# Altium schematic sheet Signal.SchDoc
size A4; SheetNumber: 2; SheetTotal: 5
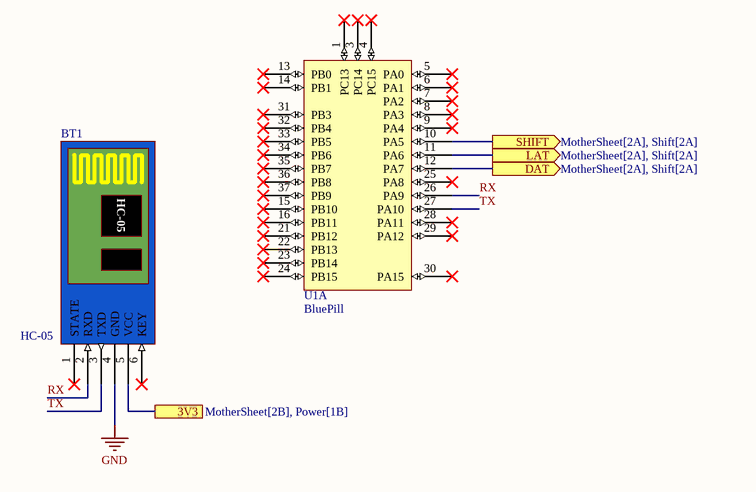
[diagram p0: Signal.SchDoc]

## Parts
BT1  HC-05  [HC-05]
U1  BluePill  [BluePill]  (part A of 2)

## Ports
3V3 (see MotherSheet[2B], Power[1B]), DAT (out, see MotherSheet[2A], Shift[2A]), LAT (out, see MotherSheet[2A], Shift[2A]), SHIFT (out, see MotherSheet[2A], Shift[2A])

## Nets
GND: BT1.4(GND)
3V3: BT1.5(VCC) ; port 3V3
DAT: U1.12(PA7) ; port DAT
LAT: U1.11(PA6) ; port LAT
RX: BT1.2(RXD) U1.26(PA9)
SHIFT: U1.10(PA5) ; port SHIFT
TX: BT1.3(TXD) U1.27(PA10)

Not connected (* = marked no-connect by the designer): BT1 1(STATE)* 6(KEY)*; U1 1(PC13)* 3(PC14)* 4(PC15)* 5(PA0)* 6(PA1)* 7(PA2)* 8(PA3)* 9(PA4)* 13(PB0)* 14(PB1)* 15(PB10)* 16(PB11)* 21(PB12)* 22(PB13)* 23(PB14)* 24(PB15)* 25(PA8)* 28(PA11)* 29(PA12)* 30(PA15)* 31(PB3)* 32(PB4)* 33(PB5)* 34(PB6)* 35(PB7)* 36(PB8)* 37(PB9)*

## Library data of the parts
U1 = BluePill: STM32F103C8T6, mbed-Enabled Development Bluepill STM32F1 ARM® Cortex®-M3 MCU 32-Bit Embedded Evaluation Board; Processor: STM32F103C9T6; Operating/input voltage: 3.3V; CPU speed: 72MHz; Analog pins: 10; Digital IO/PWM: 37; EEPROM/SRAM(KB): -/20; Flash: 64/128K; USB Connector: Micro; UART: 3; SPI: 2; I2C: 2; ComponentLink1Description: Datasheet; ComponentLink1URL: https://components101.com/microcontrollers/stm32f103c8t8-blue-pill-development-board; ComponentLink2Description: Hshop; ComponentLink2URL: https://hshop.vn/products/kit-ra-chon-stm32f103c8t6; ComponentLink3Description: Banlinhkien; ComponentLink3URL: https://banlinhkien.com/kit-stm32f103c8t6-board-mini-p6649312.html
BT1 = HC-05: ComponentLink1Description: Datasheet; ComponentLink1URL: https://www.etechnophiles.com/wp-content/uploads/2020/10/HC-05-Datasheet-Download.pdf; ComponentLink2Description: Hshop; ComponentLink2URL: https://hshop.vn/products/mach-thu-phat-bluetooth-hc-05-do-ra-chon-master; ComponentLink3Description: Banlinhkien; ComponentLink3URL: https://banlinhkien.com/module-bluetooth-hc05-p6647275.html; ComponentLink4Description: ICDayroi; ComponentLink4URL: https://icdayroi.com/module-thu-phat-bluetooth-hc-05